# Altium schematic sheet IQS5xxx.SchDoc
size A3; CheckedBy: XXX; Author: DO NOT USE THIS PARAMETER; CompanyName: Azoteq (Pty) Ltd; Engineer: DO NOT USE THIS PARAMETER; SheetNumber: 1; SheetTotal: 2; Sheet_Title: Sheet x; PageSetup: Record=PageOptions|CenterHorizontal=True|CenterVertical=True|PrintScale=1.00|XCorrection=1.00|YCorrection=1.00|PrintKind=1|BorderSize=5000000|LeftOffset=0|BottomOffset=0|Orientation=2|PaperLength=1000|PaperWidth=1000|Scale=100|PaperSource=7|PrintQuality=300|MediaType=1|DitherType=10|PaperKind=Letter|PrintScaleMode=1
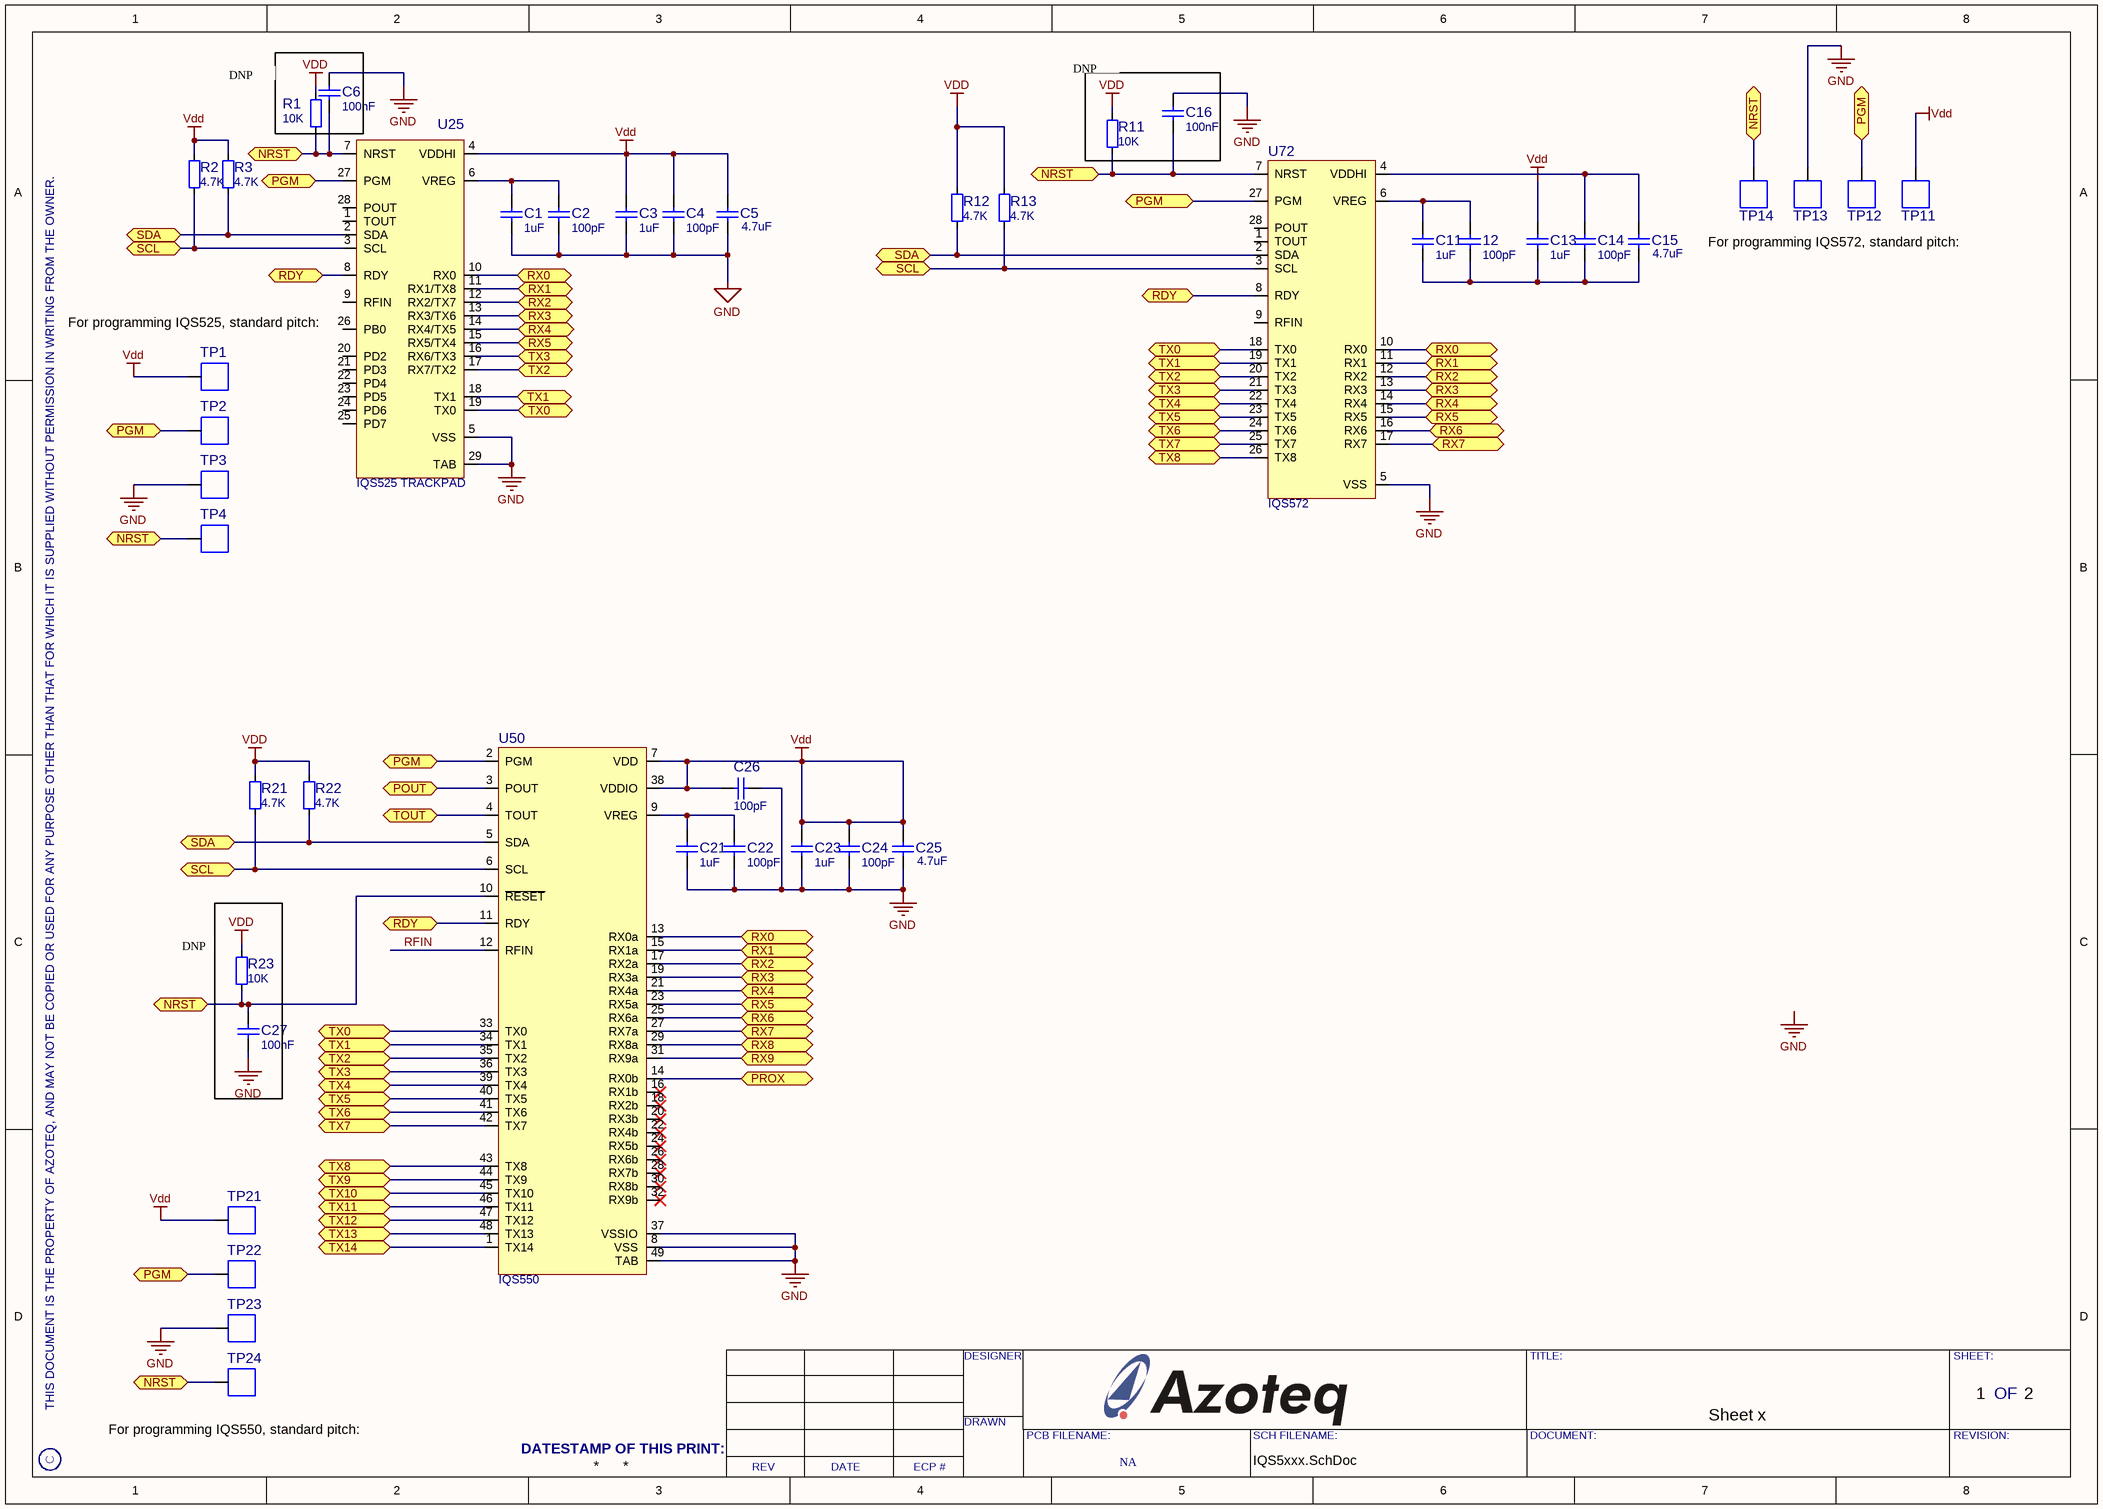
[diagram p0: IQS5xxx.SchDoc]

## Parts
12  100pF  [C-0603]
C1  1uF  [C-0603]
C2  100pF  [C-0603]
C3  1uF  [C-0603]
C4  100pF  [C-0603]
C5  4.7uF  [C-0603]
C6  100nF  [C-0603]
C11  1uF  [C-0603]
C13  1uF  [C-0603]
C14  100pF  [C-0603]
C15  4.7uF  [C-0603]
C16  100nF  [C-0603]
C21  1uF  [C-0603]
C22  100pF  [C-0603]
C23  1uF  [C-0603]
C24  100pF  [C-0603]
C25  4.7uF  [C-0603]
C26  100pF  [C-0603]
C27  100nF  [C-0603]
R1  10K  [R-0603]
R2  4.7K  [R-0603]
R3  4.7K  [R-0603]
R11  10K  [R-0603]
R12  4.7K  [R-0603]
R13  4.7K  [R-0603]
R21  4.7K  [R-0603]
R22  4.7K  [R-0603]
R23  10K  [R-0603]
TP1  (no value)  [TEST-POINT-1.5MM]  (no BOM)
TP2  (no value)  [TEST-POINT-1.5MM]  (no BOM)
TP3  (no value)  [TEST-POINT-1.5MM]  (no BOM)
TP4  (no value)  [TEST-POINT-1.5MM]  (no BOM)
TP11  (no value)  [TEST-POINT-1.5MM]  (no BOM)
TP12  (no value)  [TEST-POINT-1.5MM]  (no BOM)
TP13  (no value)  [TEST-POINT-1.5MM]  (no BOM)
TP14  (no value)  [TEST-POINT-1.5MM]  (no BOM)
TP21  (no value)  [TEST-POINT-1.5MM]  (no BOM)
TP22  (no value)  [TEST-POINT-1.5MM]  (no BOM)
TP23  (no value)  [TEST-POINT-1.5MM]  (no BOM)
TP24  (no value)  [TEST-POINT-1.5MM]  (no BOM)
U25  IQS525 TRACKPAD  [U-QFN-P0.5-4X4-28]
U50  IQS550  [U-QFN-P0.5-7X7-48]
U72  IQS572  [U-QFN-P0.5-4X4-28]

## Ports
NRST, PGM, POUT, PROX, RDY, RX0, RX1, RX2, RX3, RX4, RX5, RX6, RX7, RX8, RX9, SCL, SDA, TOUT, TX0, TX1, TX2, TX3, TX4, TX5, TX6, TX7, TX8, TX9, TX10, TX11, TX12, TX13, TX14

## Nets
GND: C1.1 C2.1 C3.1 C4.1 C5.1 C6.2 C16.2 C21.1 C22.1 C23.1 C24.1 C25.1 C26.1 C27.1 TP3.1 TP13.1 TP23.1 U25.5(VSS) U25.29(TAB) U50.8(VSS) U50.37(VSSIO) U50.49(TAB) U72.5(VSS)
Vdd: C3.2 C4.2 C5.2 C13.2 C23.2 C24.2 C25.2 C26.2 R1.2 R2.1 R3.1 R11.2 R12.2 R13.2 R21.1 R22.1 R23.2 TP1.1 TP11.1 TP21.1 U25.4(VDDHI) U50.7(VDD) U50.38(VDDIO)
NRST: C6.1 C16.1 C27.2 R1.1 R11.1 R23.1 TP4.1 TP14.1 TP24.1 U25.7(NRST) U50.10(~{RESET}) U72.7(NRST) ; port NRST
PGM: TP2.1 TP12.1 TP22.1 U25.27(PGM) U50.2(PGM) U72.27(PGM) ; port PGM
POUT: U50.3(POUT) ; port POUT
PROX: U50.14(RX0b) ; port PROX
RDY: U25.8(RDY) U50.11(RDY) U72.8(RDY) ; port RDY
RFIN: U50.12(RFIN)
RX0: U25.10(RX0) U50.13(RX0a) U72.10(RX0) ; port RX0
RX1: U25.11(RX1/TX8) U50.15(RX1a) U72.11(RX1) ; port RX1
RX2: U25.12(RX2/TX7) U50.17(RX2a) U72.12(RX2) ; port RX2
RX3: U25.13(RX3/TX6) U50.19(RX3a) U72.13(RX3) ; port RX3
RX4: U25.14(RX4/TX5) U50.21(RX4a) U72.14(RX4) ; port RX4
RX5: U25.15(RX5/TX4) U50.23(RX5a) U72.15(RX5) ; port RX5
RX6: U50.25(RX6a) U72.16(RX6) ; port RX6
RX7: U50.27(RX7a) U72.17(RX7) ; port RX7
RX8: U50.29(RX8a) ; port RX8
RX9: U50.31(RX9a) ; port RX9
SCL: R2.2 R13.1 R21.2 U25.3(SCL) U50.6(SCL) U72.3(SCL) ; port SCL
SDA: R3.2 R12.1 R22.2 U25.2(SDA) U50.5(SDA) U72.2(SDA) ; port SDA
TOUT: U50.4(TOUT) ; port TOUT
TX0: U25.19(TX0) U50.33(TX0) U72.18(TX0) ; port TX0
TX1: U25.18(TX1) U50.34(TX1) U72.19(TX1) ; port TX1
TX2: U25.17(RX7/TX2) U50.35(TX2) U72.20(TX2) ; port TX2
TX3: U25.16(RX6/TX3) U50.36(TX3) U72.21(TX3) ; port TX3
TX4: U50.39(TX4) U72.22(TX4) ; port TX4
TX5: U50.40(TX5) U72.23(TX5) ; port TX5
TX6: U50.41(TX6) U72.24(TX6) ; port TX6
TX7: U50.42(TX7) U72.25(TX7) ; port TX7
TX8: U50.43(TX8) U72.26(TX8) ; port TX8
TX9: U50.44(TX9) ; port TX9
TX10: U50.45(TX10) ; port TX10
TX11: U50.46(TX11) ; port TX11
TX12: U50.47(TX12) ; port TX12
TX13: U50.48(TX13) ; port TX13
TX14: U50.1(TX14) ; port TX14
Net12_1: 12.1 C11.1 C13.1 C14.1 C15.1
Net12_2: 12.2 C11.2 U72.6(VREG)
NetC1_2: C1.2 C2.2 U25.6(VREG)
NetC14_2: C14.2 C15.2 U72.4(VDDHI)
NetC21_2: C21.2 C22.2 U50.9(VREG)

Not connected (* = marked no-connect by the designer): U25 1(TOUT) 9(RFIN) 20(PD2) 21(PD3) 22(PD4) 23(PD5) 24(PD6) 25(PD7) 26(PB0) 28(POUT); U50 16(RX1b)* 18(RX2b)* 20(RX3b)* 22(RX4b)* 24(RX5b)* 26(RX6b)* 28(RX7b)* 30(RX8b)* 32(RX9b)*; U72 1(TOUT) 9(RFIN) 28(POUT)

## Notes on the sheet
- DNP
- For programming IQS572, standard pitch:
- For programming IQS525, standard pitch:
- (near R23) DNP
- (near TP24) For programming IQS550, standard pitch:
- NA
- Labels drawn without touching a wire or pin: GND
- DESIGNER
- TITLE:
- SHEET:
- OF
- THIS DOCUMENT IS THE PROPERTY OF AZOTEQ, AND MAY NOT BE COPIED OR USED FOR ANY PURPOSE OTHER THAN THAT FOR WHICH IT IS SUPPLIED WITHOUT PERMISSION IN WRITING FROM THE OWNER.
- C
- DATESTAMP OF THIS PRINT:
- REV
- DATE
- ECP #
- DRAWN
- PCB FILENAME:
- SCH FILENAME:
- DOCUMENT:
- REVISION:

## Library data of the parts
12 = CAP 100pF 0603 CER COG 5% 50V: Capacitor, Ceramic, 100pF, 0603, COG, 5%, 50V; Int_Part_Number: CAP0064; Generated_By: GHM; Pin_Count: 2; Checked_By: *; Checked_Date: *; Generated_Date: 2010-06-17; HelpURL: \\Dentergems\pcbcad\Datasheets\Capacitors\AVX COG Ceramic.pdf; ComponentLink1Description: Footprint Detail; ComponentLink1URL: *; ComponentLink2Description: Application Note; ComponentLink2URL: *; ComponentLink3Description: Layout Guidelines; ComponentLink3URL: *; Tolerance: 5%; Wattage: *; Voltage: 50V; Int_Note: *; Value: 100pF; Local_Supplier: Communica; Local_Supplier_PN: CHC0603 100P COG 50V; Type: SMT
C1 C3 C6 C11 C13 C16 C21 C23 C27 = CAP 1u0F 0603 CER X5R 20% 10V: Capacitor, Ceramic, 1uF, 0603, X5R, 20%, 10V; Int_Part_Number: CAP0021; Generated_By: GHM; Pin_Count: 2; Type: SMT; Checked_By: *; Checked_Date: *; Generated_Date: 2009-10-12; HelpURL: *; ComponentLink1Description: Footprint Detail; ComponentLink1URL: *; ComponentLink2Description: Application Note; ComponentLink2URL: *; ComponentLink3Description: Layout Guidelines; ComponentLink3URL: *; Tolerance: 20%; Wattage: *; Voltage: 10V; Int_Note: *
  C1 C3 C11 C13 C21 C23: Value: 1uF
  C6 C16 C27: Value: 100nF
C2 C4 C14 C22 C24 C26 = CAP 100pF 0603 CER COG 5% 50V: Capacitor, Ceramic, 100pF, 0603, COG, 5%, 50V; Int_Part_Number: CAP0064; Generated_By: GHM; Pin_Count: 2; Type: SMT; Checked_By: *; Checked_Date: *; Generated_Date: 2010-06-17; HelpURL: \\Dentergems\pcbcad\Datasheets\Capacitors\AVX COG Ceramic.pdf; ComponentLink1Description: Footprint Detail; ComponentLink1URL: *; ComponentLink2Description: Application Note; ComponentLink2URL: *; ComponentLink3Description: Layout Guidelines; ComponentLink3URL: *; Tolerance: 5%; Wattage: *; Voltage: 50V; Int_Note: *; Value: 100pF; Local_Supplier: Communica; Local_Supplier_PN: CHC0603 100P COG 50V
C5 C15 C25 = CAP 4u7F 0603 CER X5R 10% 6V3 AVX: Int_Part_Number: CAP0018; Manufacturer: AVX; Manufacturer_PN: CM105X5R475K06AT; Tolerance: 10%; Voltage: 6V3; Generated_By: GHM; Checked_By: *; Checked_Date: *; Generated_Date: 2009-10-12; HelpURL: \\Dentergems\pcbcad\Datasheets\Capacitors\AVX X5R Ceramic.pdf; ComponentLink1Description: Footprint Detail; ComponentLink1URL: *; ComponentLink2Description: Application Note; ComponentLink2URL: *; ComponentLink3Description: Layout Guidelines; ComponentLink3URL: *; Wattage: *; Int_Note: *; Value: 4.7uF
R1 R11 R23 = RES 10K 0603 1% 0.1W: Int_Part_Number: RES0025; Tolerance: 1%; Wattage: 0.1W; Generated_By: GHM; Checked_By: *; Checked_Date: *; Generated_Date: 2009-10-13; HelpURL: *; ComponentLink1Description: Footprint Detail; ComponentLink1URL: *; ComponentLink2Description: Application Note; ComponentLink2URL: *; ComponentLink3Description: Layout Guidelines; ComponentLink3URL: *; Int_Note: *; Value: 10K; Local_Supplier: Communica; Local_Supplier_PN: CHR0603 1% 10K
R2 R3 = RES 4K7 0603 1% 0.1W: Int_Part_Number: RES0003; Tolerance: 1%; Wattage: 0.1W; Generated_By: GHM; Pin_Count: 2; Checked_By: *; Checked_Date: *; Generated_Date: 2009-10-13; HelpURL: *; ComponentLink1Description: Footprint Detail; ComponentLink1URL: *; ComponentLink2Description: Application Note; ComponentLink2URL: *; ComponentLink3Description: Layout Guidelines; ComponentLink3URL: *; Int_Note: *; Value: 4.7K; Local_Supplier: Communica; Local_Supplier_PN: CHR0603 1% 4K7; Type: SMT
R12 R13 = RES 470R 0603 1% 0.1W: Resistor, 470R, 0603, 1%, 0.1W; Int_Part_Number: RES0106; Generated_By: GHM; Pin_Count: 2; Checked_By: *; Checked_Date: *; Generated_Date: 2009-10-13; HelpURL: *; ComponentLink1Description: Footprint Detail; ComponentLink1URL: *; ComponentLink2Description: Application Note; ComponentLink2URL: *; ComponentLink3Description: Layout Guidelines; ComponentLink3URL: *; Tolerance: 1%; Wattage: 0.1W; Int_Note: *; Value: 4.7K; Local_Supplier: Communica; Local_Supplier_PN: CHR0603 1% 470R; Type: SMT
R21 R22 = RES 4K7 0603 1% 0.1W: Int_Part_Number: RES0003; Tolerance: 1%; Wattage: 0.1W; Generated_By: GHM; Checked_By: *; Checked_Date: *; Generated_Date: 2009-10-13; HelpURL: *; ComponentLink1Description: Footprint Detail; ComponentLink1URL: *; ComponentLink2Description: Application Note; ComponentLink2URL: *; ComponentLink3Description: Layout Guidelines; ComponentLink3URL: *; Int_Note: *; Value: 4.7K; Local_Supplier: Communica; Local_Supplier_PN: CHR0603 1% 4K7
TP1-TP4 TP11-TP14 TP21-TP24 = TEST-POINT-SMD-1.5MM: Generated_By: GHM; Int_Part_Number: *; Checked_By: *; Checked_Date: *; HelpURL: *; ComponentLink1Description: Footprint Detail; ComponentLink1URL: *; ComponentLink2Description: Application Note; ComponentLink2URL: *; ComponentLink3Description: Layout Guidelines; ComponentLink3URL: *; Wattage: *; Int_Note: *
U25 = IQS525-QFN-4X4-28N TRACKPAD: IQS525, QFN-4x4-28, Azoteq IQS525; Generated_By: GHM; Int_Part_Number: *; Manufacturer: Azoteq; Manufacturer_PN: IQS525; Checked_By: *; Checked_Date: *; Generated_Date: 2012-06-14; HelpURL: \\Dentergems\pcbcad\Datasheets\Azoteq IC\Packaged\IQS525 Overview v0-1.pdf; ComponentLink1Description: Footprint Detail; ComponentLink1URL: *; ComponentLink2Description: Application Note; ComponentLink2URL: *; ComponentLink3Description: Layout Guidelines; ComponentLink3URL: *; Wattage: *; Int_Note: *; Value: IQS525 TRACKPAD
U50 = IQS550-QFN-48N: Manufacturer: Azoteq; Generated_By: GHM; Int_Part_Number: *; Manufacturer_PN: IQS550; Checked_By: *; Checked_Date: *; Generated_Date: 2012-04-18; HelpURL: \\Dentergems\pcbcad\Datasheets\Azoteq IC\Packaged\IQS550-V0.05.pdf; ComponentLink1Description: Footprint Detail; ComponentLink1URL: *; ComponentLink2Description: Application Note; ComponentLink2URL: *; ComponentLink3Description: Layout Guidelines; ComponentLink3URL: *; Wattage: *; Int_Note: *; Value: IQS550
U72 = IQS572-QFN-4X4-28N: IQS572, QFN-4x4-28, Azoteq IQS572; Generated_By: GHM; Int_Part_Number: *; Manufacturer: Azoteq; Manufacturer_PN: IQS572; Checked_By: *; Checked_Date: *; Generated_Date: 2013-07-05; HelpURL: \\Dentergems\pcbcad\Datasheets\Azoteq IC\Packaged\IQS572.pdf; ComponentLink1Description: Footprint Detail; ComponentLink1URL: *; ComponentLink2Description: Application Note; ComponentLink2URL: *; ComponentLink3Description: Layout Guidelines; ComponentLink3URL: *; Wattage: *; Int_Note: *; Value: IQS572